# Altium schematic sheet NEWLED.SchDoc
size A
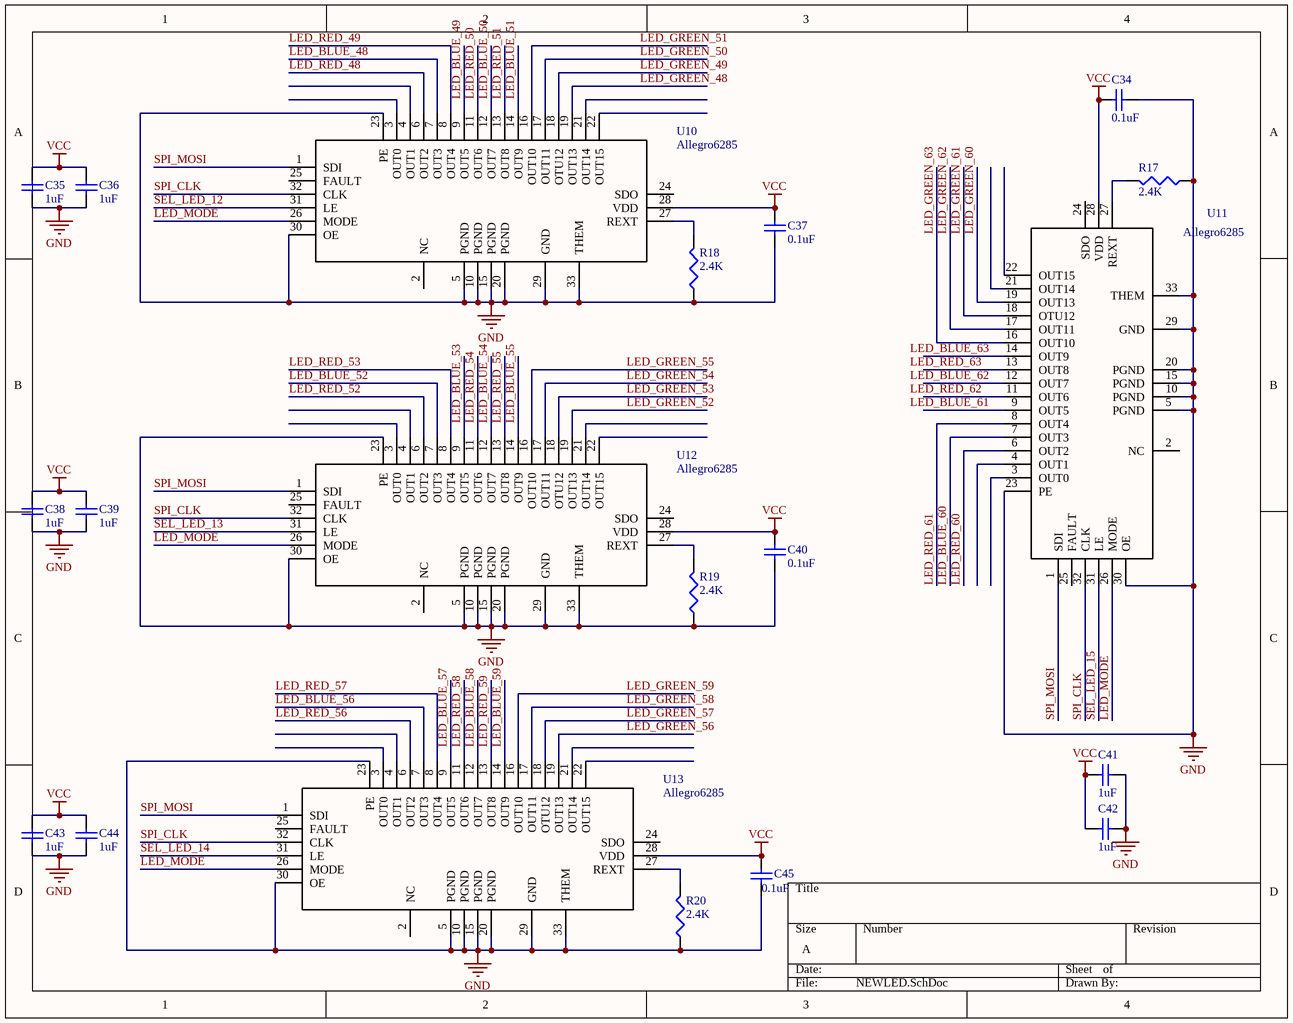
[diagram p0: NEWLED.SchDoc]

## Parts
C34  value 0.1uF  [CAPC1005L]  (hidden comment: Cap Semi)
C35  value 1uF  [CAPC1608L]  (hidden comment: Cap Semi)
C36  value 1uF  [CAPC1608L]  (hidden comment: Cap Semi)
C37  value 0.1uF  [CAPC1005L]  (hidden comment: Cap Semi)
C38  value 1uF  [CAPC1608L]  (hidden comment: Cap Semi)
C39  value 1uF  [CAPC1608L]  (hidden comment: Cap Semi)
C40  value 0.1uF  [CAPC1005L]  (hidden comment: Cap Semi)
C41  value 1uF  [CAPC1608L]  (hidden comment: Cap Semi)
C42  value 1uF  [CAPC1608L]  (hidden comment: Cap Semi)
C43  value 1uF  [CAPC1608L]  (hidden comment: Cap Semi)
C44  value 1uF  [CAPC1608L]  (hidden comment: Cap Semi)
C45  value 0.1uF  [CAPC1005L]  (hidden comment: Cap Semi)
R17  value 2.4K  [RESC1608L]  (hidden comment: Res3)
R18  value 2.4K  [RESC1608L]  (hidden comment: Res3)
R19  value 2.4K  [RESC1608L]  (hidden comment: Res3)
R20  value 2.4K  [RESC1608L]  (hidden comment: Res3)
U10  Allegro6285  [QFN-32]
U11  Allegro6285  [QFN-32]
U12  Allegro6285  [QFN-32]
U13  Allegro6285  [QFN-32]

## Nets
GND: C34.1 C35.1 C36.1 C37.1 C38.1 C39.1 C40.1 C41.1 C42.1 C43.1 C44.1 C45.1 R17.1 R18.1 R19.1 R20.1 U10.5(PGND) U10.10(PGND) U10.15(PGND) U10.20(PGND) U10.23(PE) U10.29(GND) U10.30(OE) U10.33(THEM) U11.5(PGND) U11.10(PGND) U11.15(PGND) U11.20(PGND) U11.23(PE) U11.29(GND) U11.30(OE) U11.33(THEM) U12.5(PGND) U12.10(PGND) U12.15(PGND) U12.20(PGND) U12.23(PE) U12.29(GND) U12.30(OE) U12.33(THEM) U13.5(PGND) U13.10(PGND) U13.15(PGND) U13.20(PGND) U13.23(PE) U13.29(GND) U13.30(OE) U13.33(THEM)
VCC: C34.2 C35.2 C36.2 C37.2 C38.2 C39.2 C40.2 C41.2 C42.2 C43.2 C44.2 C45.2 U10.28(VDD) U11.28(VDD) U12.28(VDD) U13.28(VDD)
LED_BLUE_48: U10.7(OUT3)
LED_BLUE_49: U10.9(OUT5)
LED_BLUE_50: U10.12(OUT7)
LED_BLUE_51: U10.14(OUT9)
LED_BLUE_52: U12.7(OUT3)
LED_BLUE_53: U12.9(OUT5)
LED_BLUE_54: U12.12(OUT7)
LED_BLUE_55: U12.14(OUT9)
LED_BLUE_56: U13.7(OUT3)
LED_BLUE_57: U13.9(OUT5)
LED_BLUE_58: U13.12(OUT7)
LED_BLUE_59: U13.14(OUT9)
LED_BLUE_60: U11.7(OUT3)
LED_GREEN_48: U10.19(OUT13)
LED_GREEN_49: U10.18(OTU12)
LED_GREEN_50: U10.17(OUT11)
LED_GREEN_51: U10.16(OUT10)
LED_GREEN_52: U12.19(OUT13)
LED_GREEN_53: U12.18(OTU12)
LED_GREEN_54: U12.17(OUT11)
LED_GREEN_55: U12.16(OUT10)
LED_GREEN_56: U13.19(OUT13)
LED_GREEN_57: U13.18(OTU12)
LED_GREEN_58: U13.17(OUT11)
LED_GREEN_59: U13.16(OUT10)
LED_GREEN_60: U11.19(OUT13)
LED_GREEN_61: U11.18(OTU12)
LED_GREEN_62: U11.17(OUT11)
LED_GREEN_63: U11.16(OUT10)
LED_MODE: U10.26(MODE) U11.26(MODE) U12.26(MODE) U13.26(MODE)
LED_RED_48: U10.6(OUT2)
LED_RED_49: U10.8(OUT4)
LED_RED_50: U10.11(OUT6)
LED_RED_51: U10.13(OUT8)
LED_RED_52: U12.6(OUT2)
LED_RED_53: U12.8(OUT4)
LED_RED_54: U12.11(OUT6)
LED_RED_55: U12.13(OUT8)
LED_RED_56: U13.6(OUT2)
LED_RED_57: U13.8(OUT4)
LED_RED_58: U13.11(OUT6)
LED_RED_59: U13.13(OUT8)
LED_RED_60: U11.6(OUT2)
LED_RED_61: U11.8(OUT4)
SEL_LED_12: U10.31(LE)
SEL_LED_13: U12.31(LE)
SEL_LED_14: U13.31(LE)
SEL_LED_15: U11.31(LE)
SPI_CLK: U10.32(CLK) U11.32(CLK) U12.32(CLK) U13.32(CLK)
SPI_MOSI: U10.1(SDI) U11.1(SDI) U12.1(SDI) U13.1(SDI)
NetR17_2: R17.2 U11.27(REXT)
NetR18_2: R18.2 U10.27(REXT)
NetR19_2: R19.2 U12.27(REXT)
NetR20_2: R20.2 U13.27(REXT)

Not connected (* = marked no-connect by the designer): U10 2(NC) 3(OUT0) 4(OUT1) 21(OUT14) 22(OUT15) 24(SDO) 25(FAULT); U11 2(NC) 3(OUT0) 4(OUT1) 9(OUT5) 11(OUT6) 12(OUT7) 13(OUT8) 14(OUT9) 21(OUT14) 22(OUT15) 24(SDO) 25(FAULT); U12 2(NC) 3(OUT0) 4(OUT1) 21(OUT14) 22(OUT15) 24(SDO) 25(FAULT); U13 2(NC) 3(OUT0) 4(OUT1) 21(OUT14) 22(OUT15) 24(SDO) 25(FAULT)

## Notes on the sheet
- Labels drawn without touching a wire or pin: LED_BLUE_61, LED_BLUE_62, LED_BLUE_63, LED_RED_62, LED_RED_63

## Library data of the parts
C34-C45 = Cap Semi: Capacitor (Semiconductor SIM Model); Published: 8-Jun-2000; LatestRevisionDate: 29-May-2009; LatestRevisionNote: IPC-7351 Footprint Added.; PackageReference: C1206; Publisher: Altium Limited; PackageDescription: Chip Capacitor
R17-R20 = Res3: Resistor; Published: 8-Jun-2000; LatestRevisionDate: 29-May-2009; LatestRevisionNote: IPC-7351 Footprint Added.; PackageReference: J1-0603; Publisher: Altium Limited; PackageDescription: Chip Resistor